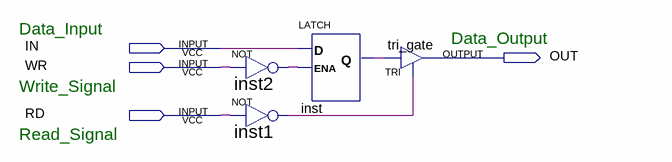
[diagram p0: schematic sheet]
// Quartus schematic Memory_Unit_1Bit.bdf as structural Verilog: 4 symbols, 4 pins
module Memory_Unit_1Bit (
  input  IN,
  input  WR,
  input  RD,
  output OUT
);

  wire inst1_out, inst2_out, inst_q;

  not inst2 (inst2_out, WR);
  not inst1 (inst1_out, RD);
  LATCH inst (.D(IN), .ENA(inst2_out), .Q(inst_q));
  TRI tri_gate (.IN(inst_q), .OE(inst1_out), .OUT(OUT));

  // Notes on the sheet:
  //   Data_Input
  //   Data_Output
  //   Write_Signal
  //   Read_Signal
endmodule
